# EAGLE design Max232 (EAGLE 4.14)
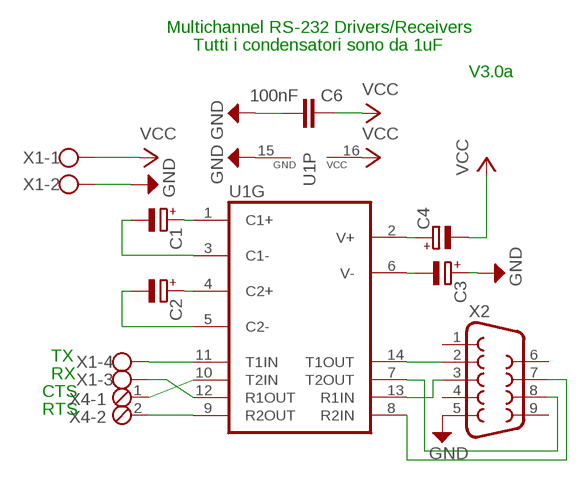
[diagram p0: schematic, sheet 1]

## Parts
C1  CPOL-EUE2-4  [E2-4]
C2  CPOL-EUE2-4  [E2-4]
C3  CPOL-EUE2-4  [E2-4]
C4  CPOL-EUE2-4  [E2-4]
C6  100nF  C-EU025-024X044  [C025-024X044]
U1  MAX3232S  [SO16]
X1  AK500/4  [AK500/4]
X2  F09HP  [F09HP]
X4  MPT2  [2POL254]

## Nets
GND: C3.+ C6.1 U1.15(P:GND) X1.2 X2.5
N$1: U1.11(G:T1IN) X1.4
N$2: U1.12(G:R1OUT) X1.3
N$3: U1.9(G:R2OUT) X4.2
N$4: U1.10(G:T2IN) X4.1
N$5: U1.14(G:T1OUT) X2.2
N$6: U1.7(G:T2OUT) X2.8
N$7: U1.13(G:R1IN) X2.3
N$8: U1.8(G:R2IN) X2.7
N$9: C1.+ U1.1(G:C1+)
N$10: C1.- U1.3(G:C1-)
N$11: C2.+ U1.4(G:C2+)
N$12: C2.- U1.5(G:C2-)
N$13: C3.- U1.6(G:V-)
N$14: C4.+ U1.2(G:V+)
VCC: C4.- C6.2 U1.16(P:VCC) X1.1
Unconnected: X2.1 X2.4 X2.6 X2.9

## Notes on the sheet
- Multichannel RS-232 Drivers/Receivers
- Tutti i condensatori sono da 1uF
- V3.0a
- TX
- RX
- CTS
- RTS

## Library data of the parts
C1-C4 = rcl:CPOL-EU: POLARIZED CAPACITOR, European symbol
C6 = rcl:C-EU: CAPACITOR, European symbol
U1 = m-pad-2.1:MAX3232: max3232CD or max3232ID digikey parts: 296-13094-1-ND and 296-13098-1-ND respectively ~$2.60 (both 16pin soic narrow, but with different temperature grades) Texas Instruments 3V to 5.5V 250kbit multichannel RS-232 line driver/receiver with +-15kV ESD protection available as TI samples and digikey carries them as well, available in SOIC16 narrow/wide package and TSSOP as well. pin compatible with maxim-ic max232 and max3232 parts
X1 = con-ptr500+:AK500/4: CONNECTOR
X2 = con-subd:F09: HARTING SUB-D
X4 = con-phoenix-254:MPT2: PHOENIX CONNECTOR

## Board
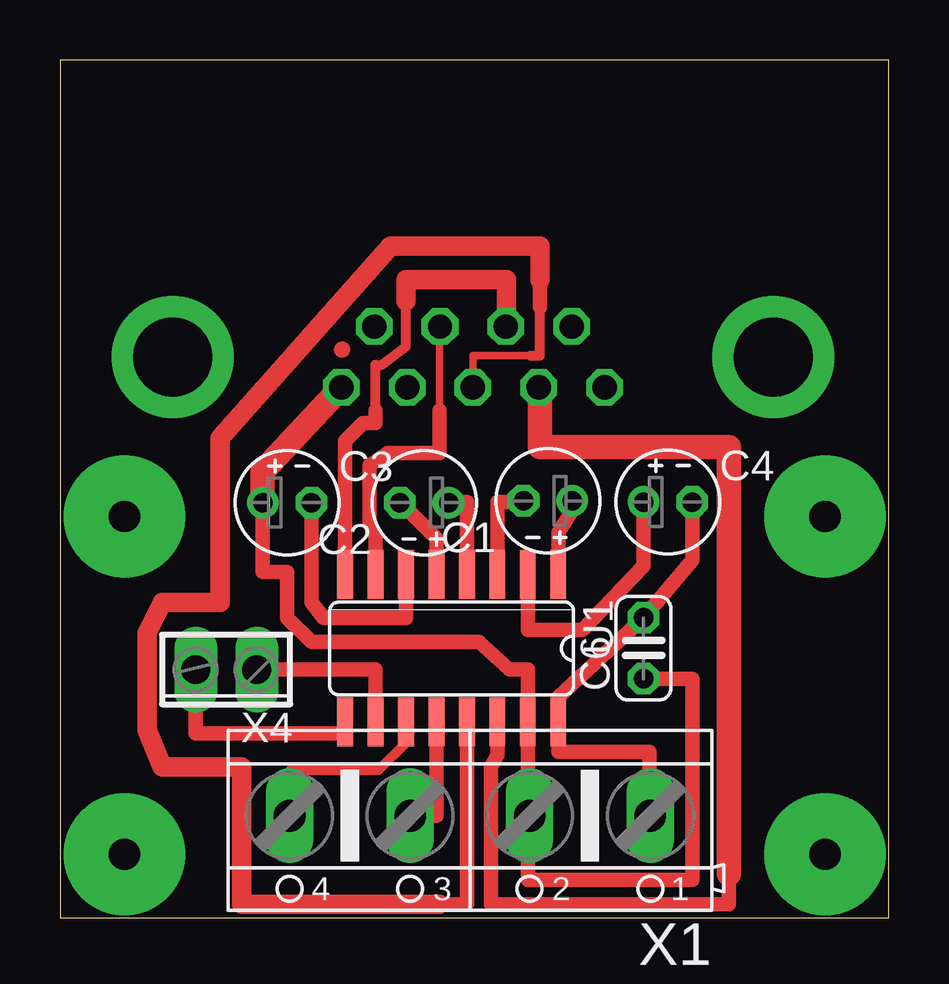
[diagram p1: board, top side]
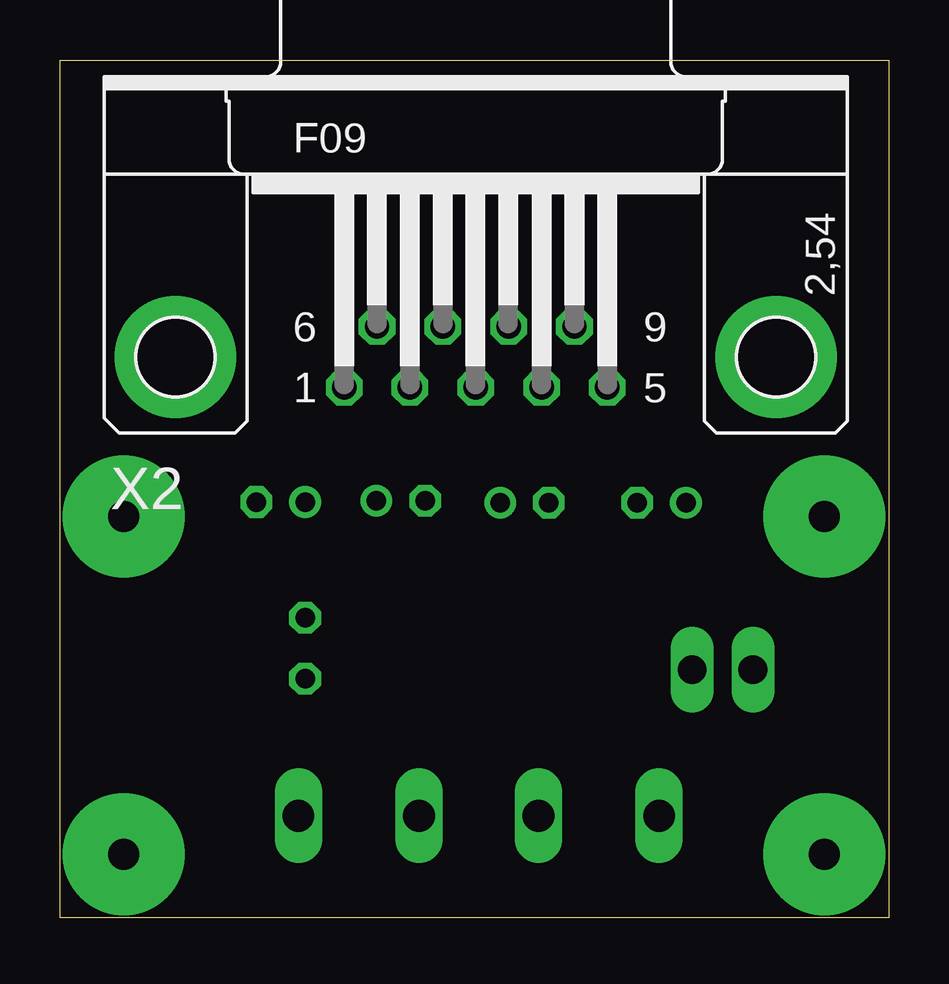
[diagram p2: board, bottom side, seen from below]

Size 34.55 x 35.76 mm. Coordinates in mm from the lower left corner, seen from the top.
Outline: 0,0 34.55,0 34.55,35.76 0,35.76 0,0
Copper layers (1*16): Top 0.035mm / dielectric 1.5mm / Bottom 0.035mm
Design rules "default": minimum track width 15mil, minimum drill 24mil, track to track 8mil, track to pad 8mil, pad to pad 8mil, via to via 8mil, smd to smd 8mil, copper to edge 40mil, drill to drill 8mil, minimum pad ring 10mil, minimum via ring 8mil, stop-mask expansion 4mil, vias tented up to drill 0mil, thermal gap 10mil

### Footprints (pad centres in the part's own frame; a part is rotated, then mirrored left to right if it is on the bottom)
E2-4 = drill 0.813 pad 1.27 round: + -1.016,0 | drill 0.813 pad 1.27 octagon: - 1.016,0
C025-024X044 = drill 0.813 octagon: 1 -1.27,0; 2 1.27,0
SO16 = smd 0.66 x 2.032: 1 -4.445,-3.073; 2 -3.175,-3.073; 3 -1.905,-3.073; 4 -0.635,-3.073; 5 0.635,-3.073; 6 1.905,-3.073; 7 3.175,-3.073; 8 4.445,-3.073; 9 4.445,3.073; 10 3.175,3.073; 11 1.905,3.073; 12 0.635,3.073; 13 -0.635,3.073; 14 -1.905,3.073; 15 -3.175,3.073; 16 -4.445,3.073
AK500/4 = drill 1.321 long: 1 -7.518,0; 2 -2.489,0; 3 2.489,0; 4 7.518,0
F09HP = drill 1.016 octagon: 1 -5.486,-1.27; 2 -2.743,-1.27; 3 0,-1.27; 4 2.743,-1.27; 5 5.486,-1.27; 6 -4.115,1.27; 7 -1.372,1.27; 8 1.372,1.27; 9 4.115,1.27 | drill 3.302 pad 5.08 round: G1 -12.522,0; G2 12.522,0
2POL254 = drill 1.2 long: 1 -1.27,0; 2 1.27,0

### Placement (x,y rotation side)
C1  20.34,17.39 180 top
C2  15.18,17.31 180 top
C3  9.47,17.31 0 top
C4  25.34,17.34 0 top
C6  24.33,11.24 90 top
U1  16.33,11.24 180 top
X1  17.09,4.25 180 top
X2  17.22,23.38 0 bottom
X4  6.93,10.35 180 top

### Tracks (layer width: path | path; a pad name or v marks a point on that pad's centre or on a via)
GND
  Top 0.61: C6.1 26.36,9.97 26.36,1.59 19.5,1.59 19.5,4.25 | 19.5,4.25 19.5,4.51 19.58,4.43 X1.2 19.5,4.25 | C3.+ 8.45,14.41 9.47,14.41 9.47,12.51 10.49,11.49 17.47,11.49 18.74,10.35 19.5,10.35 19.5,8.19 | 11.76,22.16 11.73,22.14 X2.5 | 19.5,8.19 U1.15 | 19.5,4.25 19.5,8.19
  Top 1.016: C3.+ 8.45,18.61 11.73,22.14
N$1
  Top 0.406: U1.11 14.42,7.3 13.28,6.16 9.6,6.16 9.6,4.25
  Top 0.61: X1.4 9.6,4.25
N$2
  Top 0.61: U1.12 15.69,4.25 X1.3
N$3
  Top 0.61: U1.9 11.88,7.68 5.66,7.68 X4.2
N$4
  Top 0.61: U1.10 13.15,10.35 X4.1
N$5
  Top 0.61: U1.14 18.23,6.79 17.98,6.29 17.98,0.57 27.88,0.57 27.88,1.84
  Top 0.813: 20.01,22.16 19.96,22.16 X2.2
  Top 1.016: 27.88,1.84 27.88,19.62 20.01,19.62 20.01,22.16
N$6
  Top 0.305: X2.8 15.79,24.7 15.82,24.7 15.82,21.15
  Top 0.406: 15.82,24.7 15.82,24.68 X2.8
  Top 0.61: U1.7 13.15,15.94 12.9,16.45 12.9,18.86 13.66,19.37 15.82,19.37 15.82,21.15
N$7
  Top 0.305: X2.3 17.22,23.43 19.63,23.43
  Top 0.406: 20.01,25.46 20.01,23.43 19.63,23.43
  Top 0.61: U1.13 16.96,0.57 15.82,0.57 | 20.01,25.46 20.01,26.61
  Top 0.813: 15.82,0.57 7.56,0.57 7.56,6.29 4.26,6.29 3.63,7.81 3.63,11.87 4.26,13.14 6.68,13.14 6.68,20 13.79,28 20.01,28 20.01,26.61
N$8
  Top 0.305: 18.61,24.7 X2.7
  Top 0.406: 13.15,21.15 13.15,23.05 13.41,23.05 14.42,23.81 14.42,25.72
  Top 0.61: U1.8 11.88,19.88 12.64,20.64 13.15,20.64 13.15,21.15
  Top 0.813: 18.61,24.7 18.61,26.61 14.42,26.61 14.42,25.72
N$9
  Top 0.61: C1.+ 21.46,17.13 20.77,16.07 U1.1
N$10
  Top 0.61: 19.07,17.34 19.12,17.34 | 19.07,17.34 C1.- | U1.3 18.23,17.34 19.07,17.34
N$11
  Top 0.61: U1.4 16.96,17.34 16.07,17.34 C2.+
N$12
  Top 0.61: U1.5 15.69,15.81 14.3,17.21 C2.-
N$13
  Top 0.61: C3.- 10.49,13.14 10.99,12.51 14.42,12.51 U1.6
N$14
  Top 0.61: U1.2 19.5,12 21.79,12 24.33,14.67 C4.+
N$15  (via drill 1.3 pad 5.08)
  other vias: 2.69,2.65
N$16  (via drill 1.3 pad 5.08)
  other vias: 31.9,2.65
N$17  (via drill 1.3 pad 5.08)
  other vias: 2.69,16.73
N$18  (via drill 1.3 pad 5.08)
  other vias: 31.9,16.73
VCC
  Top 0.61: C4.- 26.36,14.92 C6.2 20.77,9.21 20.77,8.19 | X1.1 24.58,4.25 24.58,6.92 20.77,6.92 20.77,8.19 | 20.77,8.19 U1.16
(copper drawn outside any net)
  shapes: Top circle x1